# EAGLE board AK4493-Combi7 (EAGLE 9.6.2), part 1 of 2
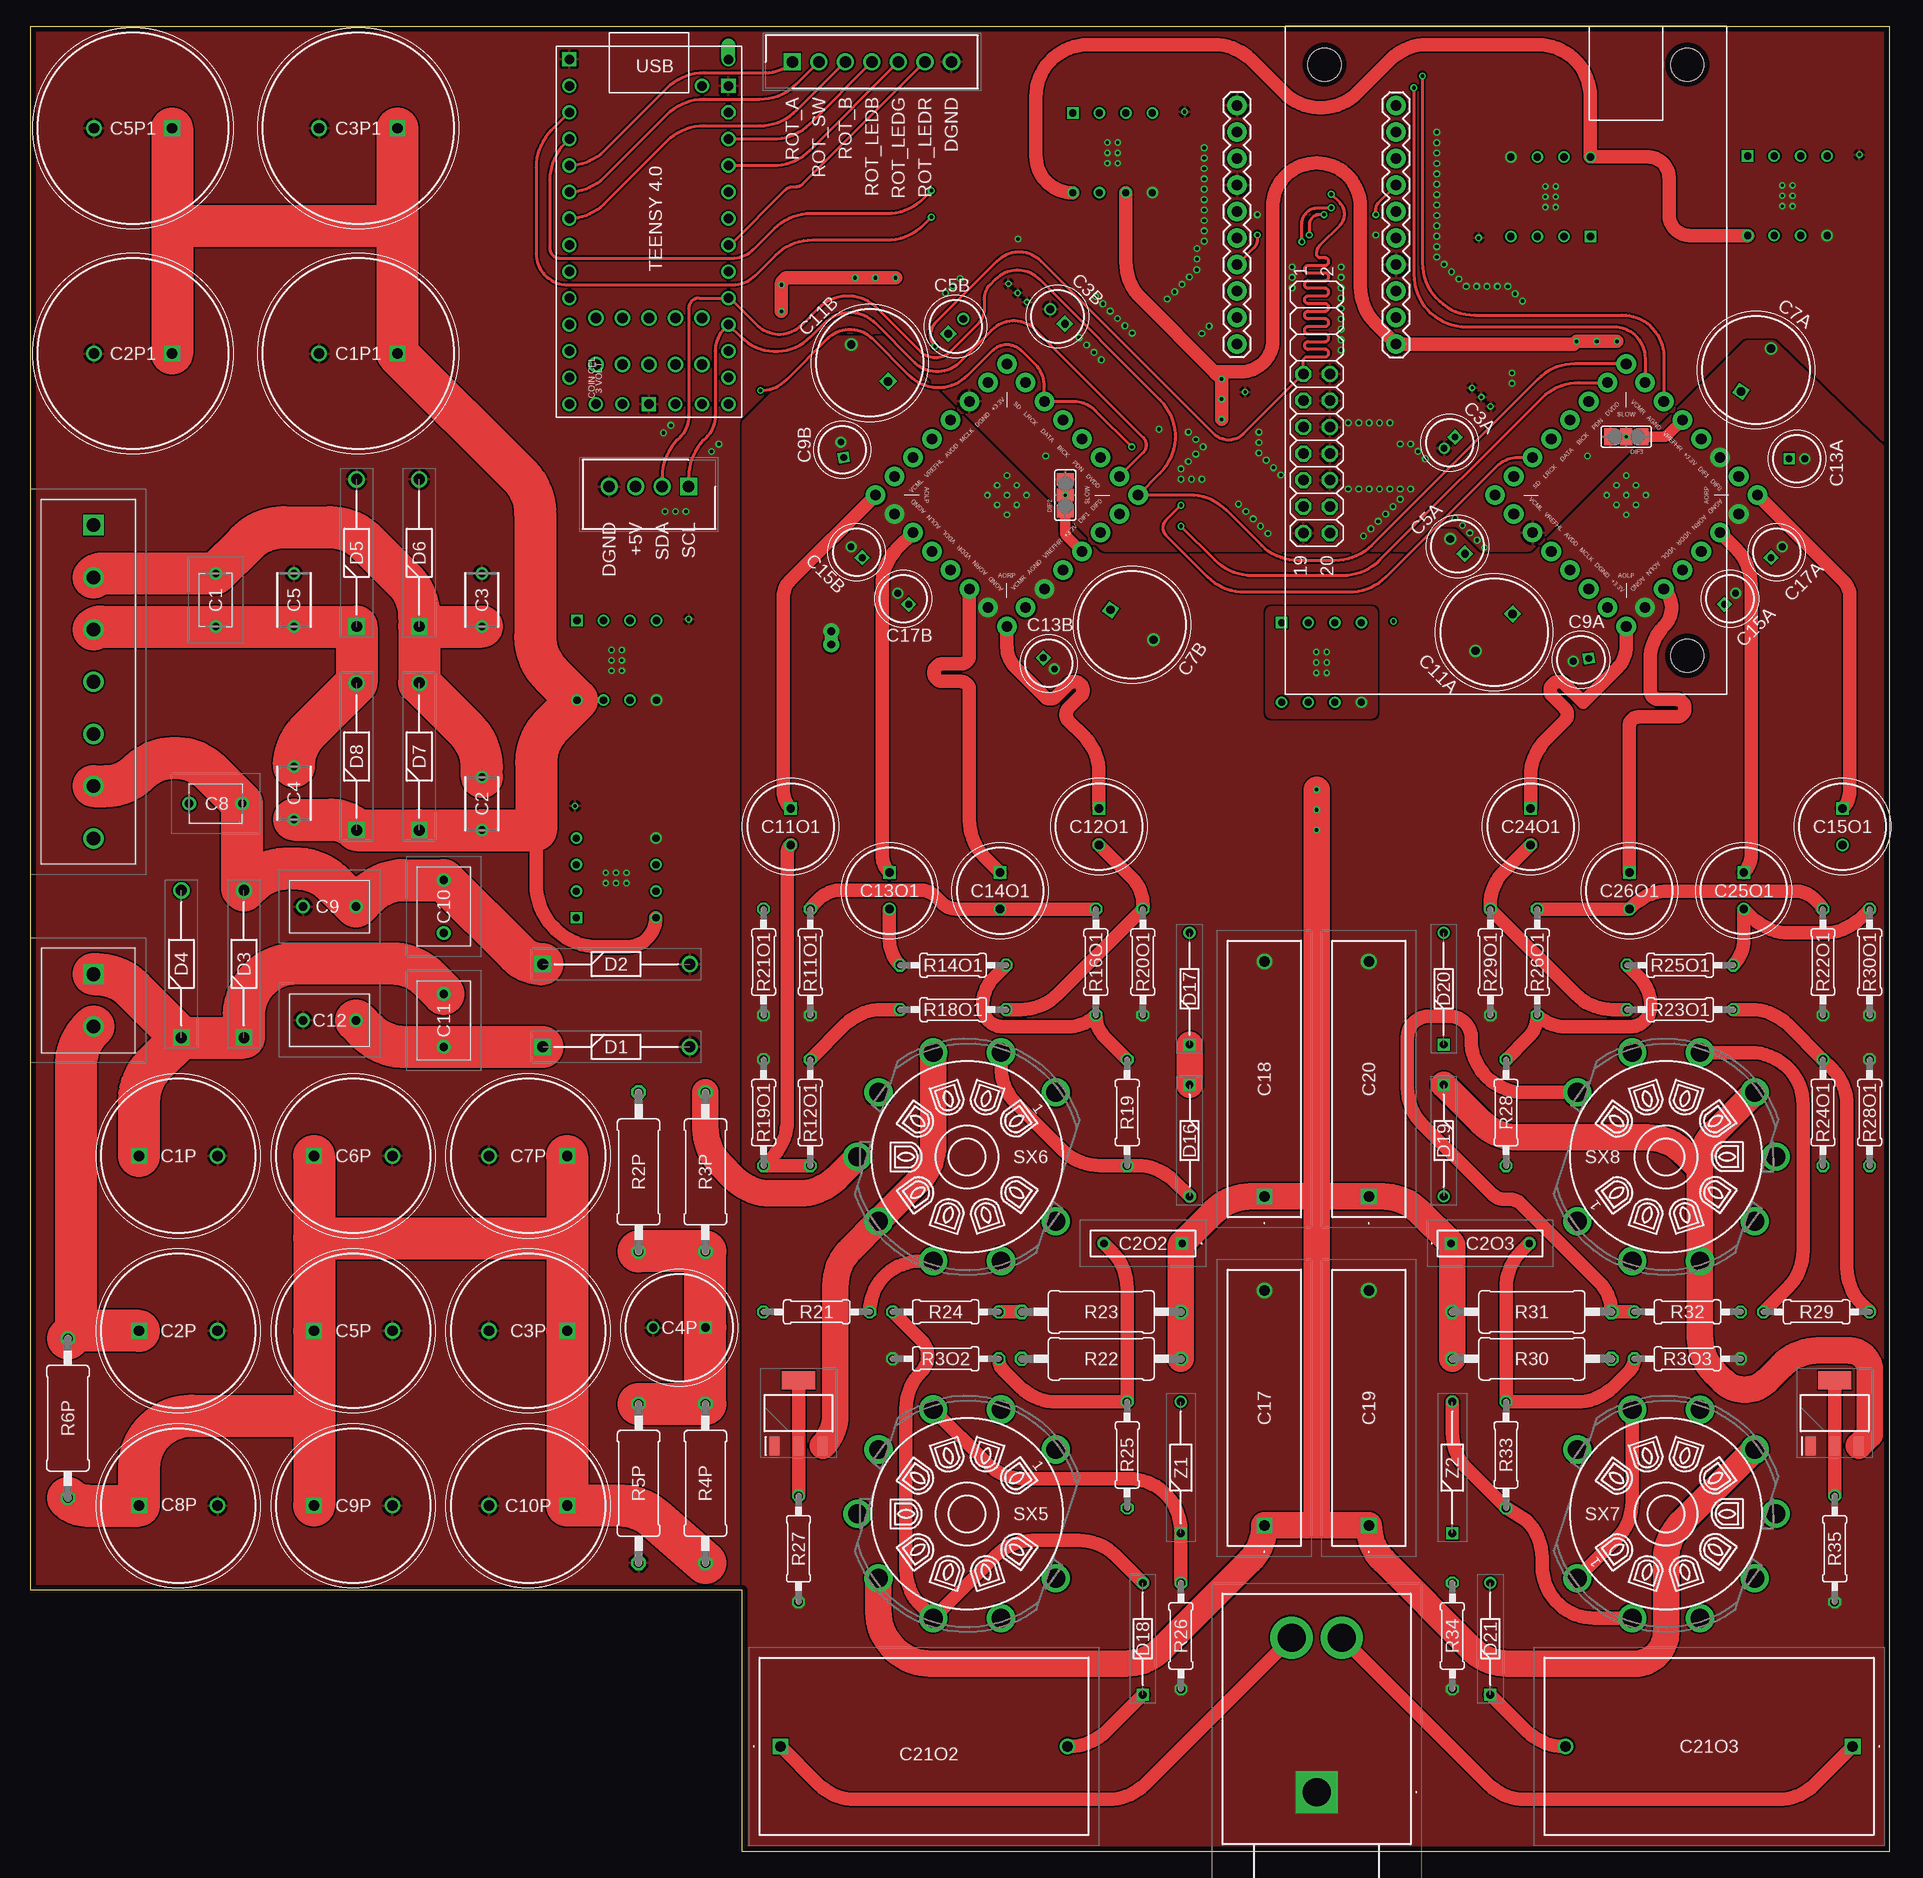
[diagram p5: board, top side]
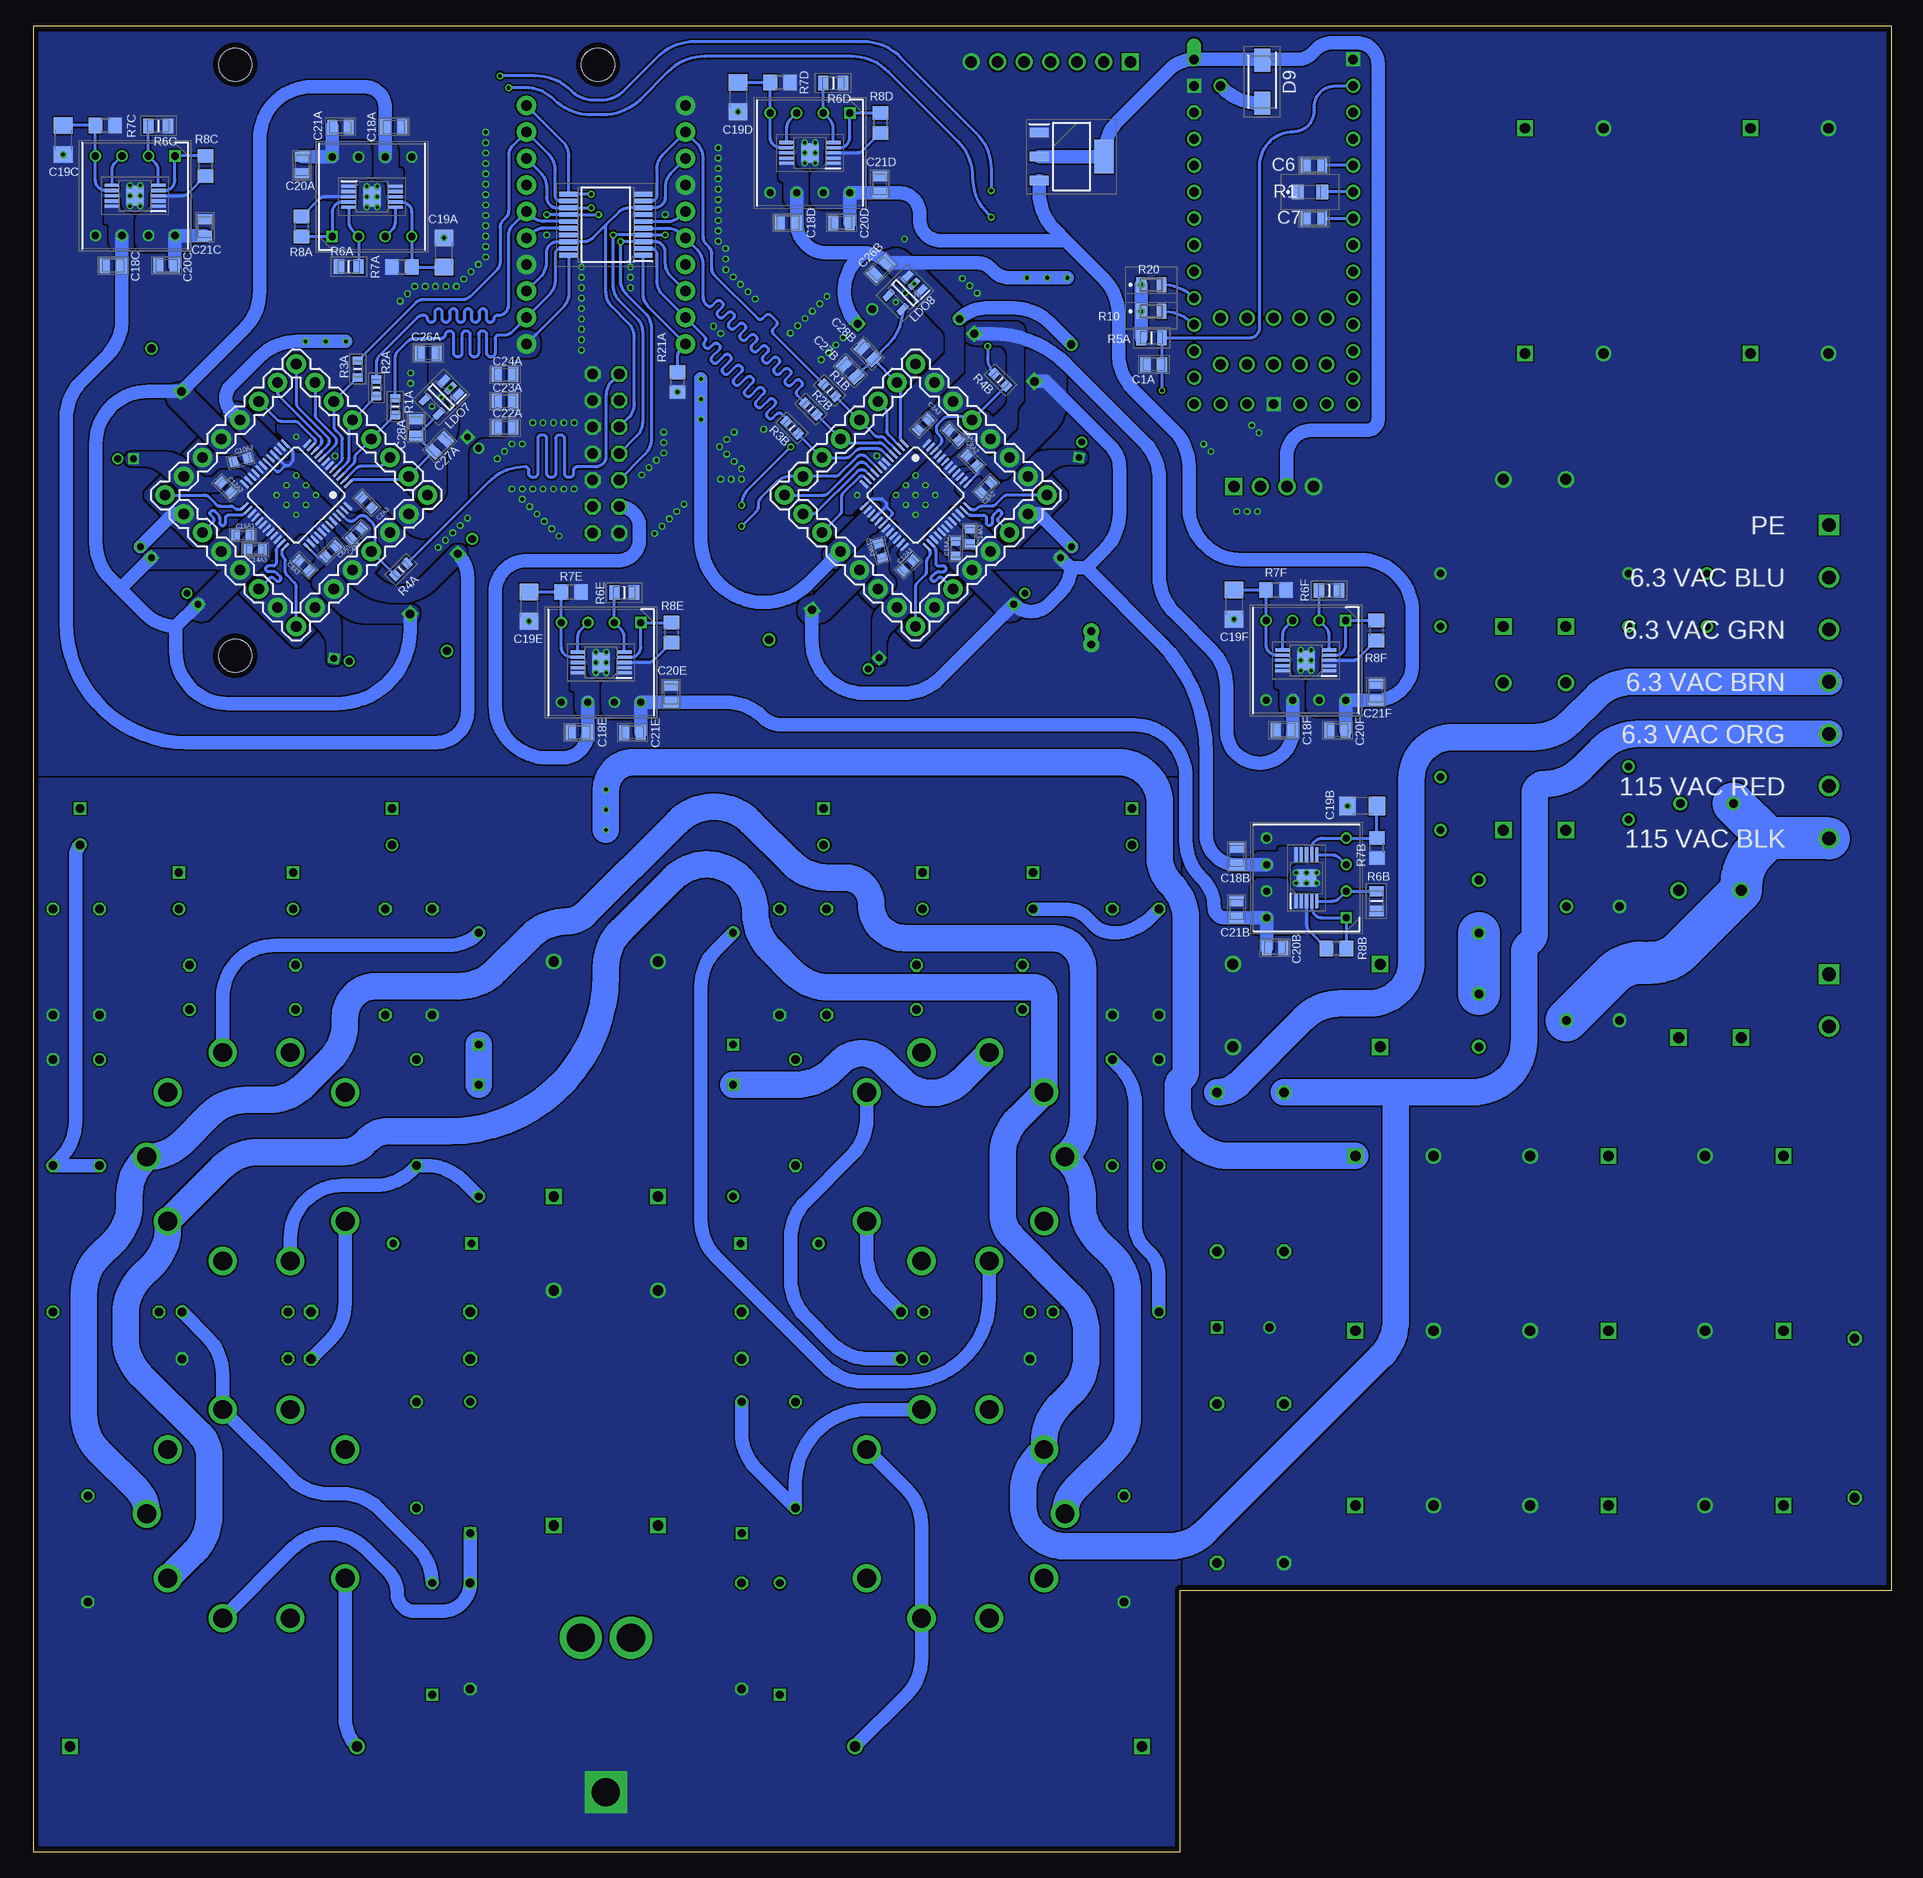
[diagram p6: board, bottom side, seen from below]

Size 178 x 174.85 mm. Coordinates in mm from the lower left corner, seen from the top.
Outline: 0,174.85 178,174.85 178,0 68.15,0 68.15,25.05 0,25.05 0,174.85
Copper layers (1*16): Top 0.035mm / dielectric 1.6mm / Bottom 0.035mm
Design rules "Elecrow_2-layer_PCB_eagle_rule": minimum track width 6mil, minimum drill 12mil, track to track 6mil, track to pad 6mil, pad to pad 6mil, via to via 8mil, smd to smd 0mil, copper to edge 20mil, drill to drill 10mil, minimum pad ring 6mil, minimum via ring 6mil, stop-mask expansion 0mil, vias tented up to drill 100mil, thermal gap 10mil
Net classes: 3 Power: width 1.27 mm, drill 1.27 mm, clearance 0.254 mm

## Footprints (pad centres in the part's own frame; a part is rotated, then mirrored left to right if it is on the bottom)
I2SOVERUSBV3 = drill 1.016 octagon: H3.7 33.322,1.745; H3.8 33.322,4.285; H3.9 35.862,1.745; H3.10 35.862,4.285; H3.11 38.403,1.745; H3.12 38.403,4.285; H3.13 40.943,1.745; H3.14 40.943,4.285; H3.15 43.483,1.745; H3.16 43.483,4.285; H3.17 46.023,1.745; H3.18 46.023,4.285; H3.19 48.562,1.745; H3.20 48.562,4.285 | hole 3.175: 3.688,3.775; 3.688,38.525; 60.312,38.525
SR211C104KARTR1 = drill 0.71 pad 1.21: 1 -2.54,0; 2 2.54,0
CAPC2012X135N = smd 0.96 x 1.39: 1 -0.79,0; 2 0.79,0
CAPPRD750W80D1475H4700 = drill 1 pad 1.5 square: 1 0,0 | drill 1 pad 1.5: 2 7.5,0
CAPPRD750W80D1825H3750 = drill 1 pad 1.5 square: 1 0,0 | drill 1 pad 1.5: 2 7.5,0
C322C104K1R5TA = drill 0.71 pad 1.21: 1 -2.54,0; 2 2.54,0
CAPC1608X95N = smd 0.81 x 0.99: 1 -0.69,0; 2 0.69,0
MKS4B031002A00JC00 = drill 0.7 pad 1.2 square: 1 0,0 | drill 0.7 pad 1.2: 2 7.5,0
CAPPRD150W45D450H600 = drill 0.65 pad 1.05 square: 1 0,0 | drill 0.65 pad 1.05: 2 1.5,0
CAPPRD200W55D500H800 = drill 0.75 pad 1.15 square: 1 0,0 | drill 0.75 pad 1.15: 2 2,0
CAPPRD500W60D1025H1750 = drill 0.8 pad 1.2 square: 1 0,0 | drill 0.8 pad 1.2: 2 5,0
CAPPRD500W60D1025H2150 = drill 0.8 pad 1.2 square: 1 0,0 | drill 0.8 pad 1.2: 2 5,0
C322C101JCG5TA7301 = drill 0.81 pad 1.316: 1 -2.54,0; 2 2.54,0
C330C104KDR5TA = drill 0.81 pad 1.316: 1 -2.54,0; 2 2.54,0
CAPPRD350W60D825H1300 = drill 0.8 pad 1.2 square: 1 0,0 | drill 0.8 pad 1.2: 2 3.5,0
MKP4G034705D00KSSD = drill 1 pad 1.5 square: 1 0,0 | drill 1 pad 1.5: 2 22.5,0
CAPC2013X140N = smd 0.96 x 1.44: 1 -0.82,0; 2 0.82,0
C1206 = smd 1.6 x 1.8: 1 -1.4,0; 2 1.4,0 | drill 0.35: 3 1.4,0
DCP4G053006ID2KSSD = drill 1 pad 1.5 square: 1 0,0 | drill 1 pad 1.5: 2 27.5,0
DIOAD1405W86L465D235 = drill 1.05 pad 1.575 square: 1 0,0 | drill 1.05 pad 1.575: 2 14.1,0
DIOM5027X244N = smd 2.2 x 1.55: 1 -2.05,0; 2 2.05,0
DIOAD1068W53L380D172 = drill 0.75 pad 1.15 square: 1 0,0 | drill 0.75 pad 1.15: 2 10.7,0
SJ_2 = smd 1.168 x 1.6: 1 -1.524,0; 2 0,0; 3 1.524,0
SOP50P490X110-11N = smd 1.425 x 0.3: 1 -2.212,1; 2 -2.212,0.5; 3 -2.212,0; 4 -2.212,-0.5; 5 -2.212,-1; 6 2.212,-1; 7 2.212,-0.5; 8 2.212,0; 9 2.212,0.5; 10 2.212,1 | smd 1.68 x 1.88: 11 0,0 | drill 0.305 pad 0.61: P$1 -0.498,0; P$2 0.498,0; P$3 -0.498,0.995; P$4 0.498,0.995; P$5 -0.498,-0.995; P$6 0.498,-0.995
LQFP48_ = smd 0.25 x 1: 1 -2.75,-4.25; 2 -2.25,-4.25; 3 -1.75,-4.25; 4 -1.25,-4.25; 5 -0.75,-4.25; 6 -0.25,-4.25; 7 0.25,-4.25; 8 0.75,-4.25; 9 1.25,-4.25; 10 1.75,-4.25; 11 2.25,-4.25; 12 2.75,-4.25; 25 2.75,4.25; 26 2.25,4.25; 27 1.75,4.25; 28 1.25,4.25; 29 0.75,4.25; 30 0.25,4.25; 31 -0.25,4.25; 32 -0.75,4.25; 33 -1.25,4.25; 34 -1.75,4.25; 35 -2.25,4.25; 36 -2.75,4.25 | smd 1 x 0.25: 13 4.25,-2.75; 14 4.25,-2.25; 15 4.25,-1.75; 16 4.25,-1.25; 17 4.25,-0.75; 18 4.25,-0.25; 19 4.25,0.25; 20 4.25,0.75; 21 4.25,1.25; 22 4.25,1.75; 23 4.25,2.25; 24 4.25,2.75; 37 -4.25,2.75; 38 -4.25,2.25; 39 -4.25,1.75; 40 -4.25,1.25; 41 -4.25,0.75; 42 -4.25,0.25; 43 -4.25,-0.25; 44 -4.25,-0.75; 45 -4.25,-1.25; 46 -4.25,-1.75; 47 -4.25,-2.25; 48 -4.25,-2.75 | drill 0.305 pad 0.61: P$1 0,0; P$2 -1.327,0; P$4 1.327,0; P$6 0,1.327; P$8 0,-1.327; P$10 -1.327,-1.327; P$17 1.327,-1.327; P$18 1.327,1.327; P$25 -1.327,1.327
SOP65P780X200-20N = smd 1.8 x 0.45: 1 -3.55,2.925; 2 -3.55,2.275; 3 -3.55,1.625; 4 -3.55,0.975; 5 -3.55,0.325; 6 -3.55,-0.325; 7 -3.55,-0.975; 8 -3.55,-1.625; 9 -3.55,-2.275; 10 -3.55,-2.925; 11 3.55,-2.925; 12 3.55,-2.275; 13 3.55,-1.625; 14 3.55,-0.975; 15 3.55,-0.325; 16 3.55,0.325; 17 3.55,0.975; 18 3.55,1.625; 19 3.55,2.275; 20 3.55,2.925
1935213 = drill 1.3 pad 1.95 square: 1 0,0 | drill 1.3 pad 1.95: 2 5,0; 3 10,0; 4 15,0; 5 20,0; 6 25,0; 7 30,0
1X07 = drill 1.016 pad 1.88: 1 0,0; 2 2.54,0; 3 5.08,0; 4 7.62,0; 5 10.16,0; 6 12.7,0; 7 15.24,0
SHDR7W64P0X254_1X7_2033X508X11 = drill 1.1 pad 1.65 square: 1 0,0 | drill 1.1 pad 1.65: 2 2.54,0; 3 5.08,0; 4 7.62,0; 5 10.16,0; 6 12.7,0; 7 15.24,0
SHDR4W64P0X254_1X4_1271X660X11 = drill 1.1 pad 1.65 square: 1 0,0 | drill 1.1 pad 1.65: 2 2.54,0; 3 5.08,0; 4 7.62,0
DIPS762W51P254L1016H390Q8N = drill 0.7 pad 1.1 square: 1 0,0 | drill 0.7 pad 1.1: 2 0,-2.54; 3 0,-5.08; 4 0,-7.62; 5 7.62,-7.62; 6 7.62,-5.08; 7 7.62,-2.54; 8 7.62,0
1X10 = drill 1.016 pad 1.88: 1 0,0; 2 2.54,0; 3 5.08,0; 4 7.62,0; 5 10.16,0; 6 12.7,0; 7 15.24,0; 8 17.78,0; 9 20.32,0; 10 22.86,0
SJ63033A = drill 2.69 pad 4.035 square: 1 0,0 | drill 2.69 pad 4.035: 2 14.8,-2.4; 3 14.8,2.4
1935161 = drill 1.3 pad 1.95 square: 1 0,0 | drill 1.3 pad 1.95: 2 5,0
SOT95P280X145-5N = smd 1.2 x 0.6: 1 -1.25,0.95; 2 -1.25,0; 3 -1.25,-0.95; 4 1.25,-0.95; 5 1.25,0.95 | drill 0.305 pad 0.61: 6 -1.25,0; 7 0,0; 8 1.25,0
ERJP06D1000V = smd 1.15 x 1.4: 1 -1.175,0; 2 1.175,0
RESC1608X55N = smd 0.8 x 0.95: 1 -0.8,0; 2 0.8,0
0411/15 = drill 0.914 octagon: 1 -7.62,0; 2 7.62,0
0207/10 = drill 0.813 octagon: 1 -5.08,0; 2 5.08,0
RESC2012X50N = smd 0.95 x 1.45: 1 -1,0; 2 1,0
RESC2012X60N = smd 1 x 1.4: 1 -0.95,0; 2 0.95,0
R0805 = smd 1.3 x 1.5: 1 -0.95,0; 2 0.95,0
RCS0805_E3 = smd 0.95 x 1.45: 1 -0.975,0; 2 0.975,0
R0805-POL = smd 1.3 x 1.5: 1 -0.95,0; 2 0.95,0 | drill 0.305 pad 0.61: 3 0.95,0
SHORT_ALL-50 = drill 0.737 pad 1.524: 1 -0.635,0; 2 0.635,0
VT9-PT = drill 1.8 pad 2.4: 1 6.172,8.495; 2 0,10.5; 3 -6.172,8.495; 4 -9.986,3.245; 5 -9.986,-3.245; 6 -6.172,-8.495; 7 0,-10.5; 8 6.172,-8.495; 9 9.986,-3.244
SOT230P700X180-4N@1 = smd 1.85 x 0.9: 1 -3.1,2.3; 2 -3.1,0; 3 -3.1,-2.3 | smd 1.85 x 3.2: 4 3.1,0
SOT230P700X180-4N = smd 1.75 x 0.95: 1 -3.15,2.3; 2 -3.15,0; 3 -3.15,-2.3 | smd 1.75 x 3.2: 4 3.15,0
TEENSY40 = drill 0.9: 0-RX1 -13.97,-7.62; 1-TX1 -11.43,-7.62; 2-OUT2 -8.89,-7.62; 3-LRCLK2 -6.35,-7.62; 3V3-2 16.51,-2.54; 4-BCLK2 -3.81,-7.62; 5-IN2 -1.27,-7.62; 6-OUT1D 1.27,-7.62; 7-RX2/OUT1A 3.81,-7.62; 8-TX2/IN1 6.35,-7.62; 9-OUT1C 8.89,-7.62; 10-CS/MQSR 11.43,-7.62; 11-MOSI/CTX1 13.97,-7.62; 12-MIO/MQSL 16.51,-7.62; 13-SCK/CRX1/LED 16.51,7.62; 14-A0/TX3/S-PFI_OUT 13.97,7.62; 15-A1/RX3/S-PDIF_IN 11.43,7.62; 16-A2/RX4/SCL1 8.89,7.62; 17-A3/TX4/SDA1 6.35,7.62; 18-A4/SDA0 3.81,7.62; 19-A5/SCL0 1.27,7.62; 20-A6/TX5/LRCLK1 -1.27,7.62; 21-A7/RX5/BCLK1 -3.81,7.62; 22-A8/CTX1 -6.35,7.62; 23-A9/CRX1/CCLK1 -8.89,7.62; ON/OFF 16.51,5.08; PROGRAM 16.51,2.54; VBAT 16.51,-5.08; VUSB -13.97,5.08 | drill 0.9 octagon: 3V3-1 -11.43,7.62 | drill 1: 24-A10/TX6/SCL2 12.7,5.08; 25-A11/SDA2 8.255,5.08; 26-A12/MOSI1 12.7,2.54; 27-A13/SCK1 8.255,2.54; 28-RX7 12.7,0; 29-TX7 8.255,0; 30-CRX3 12.7,-2.54; 31-CTX3 8.255,-2.54; 32-OUTB1 12.7,-5.08; 33-MCLK2 8.255,-5.08 | drill 0.9 square: GND1 -16.51,-7.62; GND2 16.51,0; GND3 -13.97,7.62 | drill 0.9 offset: VIN -16.51,7.62
DIOAD1256W56L444D203 = drill 0.75 pad 1.15 square: 1 0,0 | drill 0.75 pad 1.15: 2 12.6,0

## Placement (x,y rotation side)
BD1  I2SOVERUSBV3  [I2SOVERUSBV3]  120.14,174.85 270 top
C1  SR215C103KARTR1  [SR211C104KARTR1]  17.7,119.88 90 top
C1A  0.1uF, X7R  [CAPC2012X135N]  70.68,142.45 180 bottom
C1P  68u  [CAPPRD750W80D1475H4700]  10.38,66.64 0 top
C1P1  68u  [CAPPRD750W80D1825H3750]  35.11,143.49 180 top
C2  C322C104M5U5TA  [C322C104K1R5TA]  43.2,100.38 90 top
C2A2  0.1u, Ceramic Capacitor X7R  [CAPC1608X95N]  92.76,136.67 45 bottom
C2A3  0.1u, Ceramic Capacitor X7R  [CAPC1608X95N]  146.07,129.2 315 bottom
C2O2  0.1uF, 35V  [MKS4B031002A00JC00]  110.28,58.25 180 top
C2O3  0.1uF, 35V  [MKS4B031002A00JC00]  136.03,58.25 0 top
C2P  68u  [CAPPRD750W80D1475H4700]  10.38,49.89 0 top
C2P1  68u  [CAPPRD750W80D1825H3750]  13.54,143.49 180 top
C3  C322C104M5U5TA  [C322C104K1R5TA]  43.2,119.88 90 top
C3A  80-A758BG106M1EAAE70  [CAPPRD150W45D450H600]  136.42,135.49 225 top
C3B  80-A758BG106M1EAAE70  [CAPPRD200W55D500H800]  99.05,146.33 135 top
C3P  68u  [CAPPRD750W80D1475H4700]  51.38,49.89 180 top
C3P1  68u  [CAPPRD750W80D1825H3750]  35.11,165.07 180 top
C4  C322C104M5U5TA  [C322C104K1R5TA]  25.2,101.38 90 top
C4A2  0.1u, Ceramic Capacitor X7R  [CAPC1608X95N]  89.83,135.68 135 bottom
C4A3  0.1u, Ceramic Capacitor X7R  [CAPC1608X95N]  147.06,126.27 45 bottom
C4P  UCY2E220MPD1TD  [CAPPRD500W60D1025H1750]  64.61,50.19 180 top
C5  C322C104M5U5TA  [C322C104K1R5TA]  25.2,119.88 90 top
C5A  80-A758BG106M1EAAE70  [CAPPRD200W55D500H800]  137.36,124.32 135 top
C5B  80-A758BG106M1EAAE70  [CAPPRD200W55D500H800]  87.88,145.38 45 top
C5P  68u  [CAPPRD750W80D1475H4700]  27.13,49.89 0 top
C5P1  68u  [CAPPRD750W80D1825H3750]  13.54,165.07 180 top
C6  0.1 uF  [CAPC2012X135N]  55.34,161.5 180 bottom
C6A2  0.1u, Ceramic Capacitor X7R  [CAPC1608X95N]  88.09,133.24 315 bottom
C6A3  0.1u, Ceramic Capacitor X7R  [CAPC1608X95N]  149.51,124.53 225 bottom
C6P  68u  [CAPPRD750W80D1475H4700]  27.13,66.64 0 top
C7  0.1 uF  [CAPC2012X135N]  55.34,156.42 0 bottom
C7A  APSG160ELL222MJ20S  [CAPPRD500W60D1025H2150]  163.8,139.87 55 top
C7B  APSG160ELL222MJ20S  [CAPPRD500W60D1025H2150]  103.43,118.94 325 top
C7P  68u  [CAPPRD750W80D1475H4700]  51.38,66.64 180 top
C8  C322C103KDR5TA  [C322C101JCG5TA7301]  17.7,100.38 0 top
C8A2  0.1u, Ceramic Capacitor X7R  [CAPC1608X95N]  86.75,130.66 45 bottom
C8A3  0.1u, Ceramic Capacitor X7R  [CAPC1608X95N]  152.09,123.19 315 bottom
C8P  68u  [CAPPRD750W80D1475H4700]  10.38,33.14 0 top
C9  C330C104KDR5TA  [C330C104KDR5TA]  28.61,90.52 180 top
C9A  647-RNU1A100MDSASQ  [CAPPRD150W45D450H600]  149.21,114.29 190 top
C9B  647-RNU1A100MDSASQ  [CAPPRD150W45D450H600]  77.85,133.53 100 top
C9P  68u  [CAPPRD750W80D1475H4700]  27.13,33.14 0 top
C10  C330C104KDR5TA  [C330C104KDR5TA]  39.55,90.52 90 top
C10A2  0.1u, Ceramic Capacitor X7R  [CAPC1608X95N]  96.87,124.61 285 bottom
C10A3  0.1u, Ceramic Capacitor X7R  [CAPC1608X95N]  158.14,133.31 195 bottom
C10P  68u  [CAPPRD750W80D1475H4700]  51.38,33.14 180 top
C11  C330C104KDR5TA  [C330C104KDR5TA]  39.55,79.62 270 top
C11A  APSG160ELL222MJ20S  [CAPPRD500W60D1025H2150]  141.92,118.55 225 top
C11B  2200uF, 10V  [CAPPRD500W60D1025H2150]  82.11,140.83 135 top
C11O1  100uF  [CAPPRD350W60D825H1300]  72.78,99.93 270 top
C12  C330C104KDR5TA  [C330C104KDR5TA]  28.61,79.62 180 top
C12A2  0.1u, Ceramic Capacitor X7R  [CAPC1608X95N]  94.21,123.2 45 bottom
C12A3  0.1u, Ceramic Capacitor X7R  [CAPC1608X95N]  159.55,130.65 315 bottom
C12O1  100uF  [CAPPRD350W60D825H1300]  102.3,99.93 270 top
C13A  647-RNU1A100MDSASQ  [CAPPRD150W45D450H600]  168.41,133.42 0 top
C13B  647-RNU1A100MDSASQ  [CAPPRD150W45D450H600]  96.98,114.34 315 top
C13O1  100uF  [CAPPRD350W60D825H1300]  82.24,93.78 270 top
C14A2  0.1u, Ceramic Capacitor X7R  [CAPC1608X95N]  88.27,126.01 270 bottom
C14A3  0.1u, Ceramic Capacitor X7R  [CAPC1608X95N]  156.74,124.71 180 bottom
C14O1  100uF  [CAPPRD350W60D825H1300]  92.84,93.78 270 top
C15A  647-RNU1A100MDSASQ  [CAPPRD150W45D450H600]  162.22,119.47 45 top
C15B  647-RNU1A100MDSASQ  [CAPPRD150W45D450H600]  79.62,123.93 135 top
C15O1  100uF  [CAPPRD350W60D825H1300]  173.53,99.93 270 top
C16A2  0.1u, Ceramic Capacitor X7R  [CAPC1608X95N]  89.65,124.8 90 bottom
C16A3  0.1u, Ceramic Capacitor X7R  [CAPC1608X95N]  157.94,126.09 0 bottom
C17  MKP4G034705D00KSSD  [MKP4G034705D00KSSD]  118.15,31.25 90 top
C17A  647-RNU1A100MDSASQ  [CAPPRD150W45D450H600]  166.68,123.93 45 top
C17B  647-RNU1A100MDSASQ  [CAPPRD150W45D450H600]  84.08,119.47 135 top
C18  MKP4G034705D00KSSD  [MKP4G034705D00KSSD]  118.15,62.75 90 top
C18A  4.7u  [CAPC2013X140N]  143.47,165.2 0 bottom
C18B  4.7u  [CAPC2013X140N]  62.75,95.35 90 bottom
C18C  4.7u  [CAPC2013X140N]  170.34,151.91 180 bottom
C18D  4.7u  [CAPC2013X140N]  105.7,156.02 180 bottom
C18E  4.7u  [CAPC2013X140N]  125.71,107.21 180 bottom
C18F  4.7u  [CAPC2013X140N]  58.2,107.41 180 bottom
C19  MKP4G034705D00KSSD  [MKP4G034705D00KSSD]  128.15,31.25 90 top
C19A  22u  [C1206]  138.67,153.17 90 bottom
C19B  22u  [C1206]  50.71,100.15 180 bottom
C19C  22u  [C1206]  175.14,163.94 270 bottom
C19D  22u  [C1206]  110.5,168.05 270 bottom
C19E  22u  [C1206]  130.52,119.24 270 bottom
C19F  22u  [C1206]  63,119.44 270 bottom
C20  MKP4G034705D00KSSD  [MKP4G034705D00KSSD]  128.15,62.75 90 top
C20A  10u  [CAPC2012X135N]  152.26,161.53 270 bottom
C20B  10u  [CAPC2012X135N]  59.07,86.57 0 bottom
C20C  10u  [CAPC2012X135N]  165.23,151.91 180 bottom
C20D  10u  [CAPC2012X135N]  100.59,156.02 180 bottom
C20E  10u  [CAPC2012X135N]  116.93,110.88 90 bottom
C20F  10u  [CAPC2012X135N]  53.09,107.41 180 bottom
C21A  0.1u  [CAPC2012X135N]  148.58,165.2 0 bottom
C21B  0.1u  [CAPC2012X135N]  62.75,90.24 90 bottom
C21C  0.1u  [CAPC2012X135N]  161.56,155.58 90 bottom
C21D  0.1u  [CAPC2012X135N]  96.92,159.69 90 bottom
C21E  0.1u  [CAPC2012X135N]  120.6,107.21 180 bottom
C21F  0.1u  [CAPC2012X135N]  49.41,111.08 90 bottom
C21O2  30uF/400V  [DCP4G053006ID2KSSD]  71.8,10.08 0 top
C21O3  30uF/400V  [DCP4G053006ID2KSSD]  174.5,10.08 180 top
C22A  0.1u, Ceramic Capacitor X7R  [CAPC2012X135N]  132.8,136.39 0 bottom
C23A  0.1u, Ceramic Capacitor X7R  [CAPC2012X135N]  132.8,138.93 0 bottom
C24A  0.1u, Ceramic Capacitor X7R  [CAPC2012X135N]  132.8,141.47 0 bottom
C24O1  100uF  [CAPPRD350W60D825H1300]  143.65,99.93 270 top
C25O1  100uF  [CAPPRD350W60D825H1300]  164.07,93.78 270 top
C26A  4.7u, Ceramic Capacitor X7R  [CAPC2013X140N]  140.17,143.53 180 bottom
C26B  4.7u, Ceramic Capacitor X7R  [CAPC2013X140N]  96.83,151.61 225 bottom
C26O1  100uF  [CAPPRD350W60D825H1300]  153.11,93.78 270 top
C27A  4.7u, Ceramic Capacitor X7R  [CAPC2013X140N]  139.08,134.69 45 bottom
C27B  4.7u, Ceramic Capacitor X7R  [CAPC2013X140N]  99.76,141.87 135 bottom
C28A  0.1u, Ceramic Capacitor X7R  [CAPC2012X135N]  141.35,136.43 90 bottom
C28B  0.1u, Ceramic Capacitor X7R  [CAPC2012X135N]  98.08,143.51 135 bottom
D1  1N4007FFG  [DIOAD1405W86L465D235]  49.01,77.08 0 top
D2  1N4007FFG  [DIOAD1405W86L465D235]  49.01,85 0 top
D3  1N4007FFG  [DIOAD1405W86L465D235]  20.41,77.97 90 top
D4  1N4007FFG  [DIOAD1405W86L465D235]  14.41,77.97 90 top
D5  1N4007FFG  [DIOAD1405W86L465D235]  31.2,117.34 90 top
D6  1N4007FFG  [DIOAD1405W86L465D235]  37.2,117.34 90 top
D7  1N4007FFG  [DIOAD1405W86L465D235]  37.2,97.84 90 top
D8  1N4007FFG  [DIOAD1405W86L465D235]  31.2,97.84 90 top
D9  SS14_R2_00001  [DIOM5027X244N]  60.3,169.51 270 bottom
D16  1N4148-T50R  [DIOAD1068W53L380D172]  110.98,73.45 270 top
D17  1N4148-T50R  [DIOAD1068W53L380D172]  110.98,77.3 90 top
D18  1N4148-T50R  [DIOAD1068W53L380D172]  106.51,15.04 90 top
D19  1N4148-T50R  [DIOAD1068W53L380D172]  135.33,73.45 270 top
D20  1N4148-T50R  [DIOAD1068W53L380D172]  135.33,77.3 90 top
D21  1N4148-T50R  [DIOAD1068W53L380D172]  139.8,15.04 90 top
DIF2  [SJ_2]  99.08,129.93 270 top
DIF3  [SJ_2]  152.81,135.52 0 top
IC1  LT3042  [SOP50P490X110-11N]  145.56,158.51 0 bottom
IC3  AK4493  [LQFP48_]  93.49,129.93 225 bottom
IC4  LT3042  [SOP50P490X110-11N]  168.25,158.6 180 bottom
IC4A  SN74ABT273DBR  [SOP65P780X200-20N]  123.15,155.82 180 bottom
IC5  LT3042  [SOP50P490X110-11N]  56.05,93.26 90 bottom
IC6  LT3042  [SOP50P490X110-11N]  103.61,162.71 180 bottom
IC7  LT3042  [SOP50P490X110-11N]  56.11,114.1 180 bottom
IC8  LT3042  [SOP50P490X110-11N]  123.62,113.9 180 bottom
IC9  AK4493  [LQFP48_]  152.81,129.93 135 bottom
IN  1935213  [1935213]  6,127.05 270 top
J1  [1X07]  93.49,117.36 135 bottom
J2  [1X07]  80.92,129.93 225 bottom
J3  [1X07]  93.49,142.5 315 bottom
J4  [1X07]  106.06,129.93 45 bottom
J5  70543-0041  [SHDR7W64P0X254_1X7_2033X508X11]  72.93,171.43 0 top
J6  70543-0038  [SHDR4W64P0X254_1X4_1271X660X11]  63.01,130.75 180 top
J9  [1X07]  165.39,129.93 45 bottom
J10  [1X07]  152.81,117.36 135 bottom
J11  [1X07]  140.24,129.93 225 bottom
J12  [1X07]  152.81,142.5 315 bottom
J15  XR2A-0811-N  [DIPS762W51P254L1016H390Q8N]  149.37,154.7 90 bottom
J16  XR2A-0811-N  [DIPS762W51P254L1016H390Q8N]  164.44,162.41 270 bottom
J17  XR2A-0811-N  [DIPS762W51P254L1016H390Q8N]  52.24,89.45 180 bottom
J18  XR2A-0811-N  [DIPS762W51P254L1016H390Q8N]  99.8,166.52 270 bottom
J19  XR2A-0811-N  [DIPS762W51P254L1016H390Q8N]  52.3,117.91 270 bottom
J20  XR2A-0811-N  [DIPS762W51P254L1016H390Q8N]  119.81,117.71 270 bottom
J21  [1X10]  115.53,167.25 270 top
J22  [1X10]  130.77,144.39 90 top
J26  SJ-63033A  [SJ63033A]  123.15,5.7 90 top
J27  1935161  [1935161]  6,84.04 270 top
LDO7  LP5907-1.8V  [SOT95P280X145-5N]  138.93,139.31 225 bottom
LDO8  LP5907-1.8V  [SOT95P280X145-5N]  94.52,149.3 225 bottom
R1  5k  [ERJP06D1000V]  55.73,158.96 0 bottom
R1A  RT0603DRE075R1L  [RESC1608X55N]  143.34,138.41 270 bottom
R1B  RT0603DRE075R1L  [RESC1608X55N]  101.74,139.97 315 bottom
R2A  RT0603DRE075R1L  [RESC1608X55N]  145.14,140.21 270 bottom
R2B  RT0603DRE075R1L  [RESC1608X55N]  103.53,138.18 315 bottom
R2P  220  [0411/15]  58.21,65.1 90 top
R3A  RT0603DRE075R1L  [RESC1608X55N]  146.93,142 270 bottom
R3B  RT0603DRE075R1L  [RESC1608X55N]  105.33,136.38 315 bottom
R3O2  1M*  [0207/10]  87.63,47.2 180 top
R3O3  1M*  [0207/10]  158.68,47.2 0 top
R3P  220  [0411/15]  64.61,65.1 270 top
R4A  RT0603DRE075R1L  [RESC1608X55N]  142.77,122.82 225 bottom
R4B  RT0603DRE075R1L  [RESC1608X55N]  85.38,140.97 315 bottom
R4P  300k  [0411/15]  64.61,35.27 270 top
R5A  10K, Resistor 1%  [RESC2012X50N]  70.89,144.99 180 bottom
R5P  100k  [0411/15]  58.21,35.27 90 top
R6A  1k  [RESC2012X60N]  147.78,151.82 180 bottom
R6B  1k  [RESC2012X60N]  49.36,91.04 270 bottom
R6C  1k  [RESC2012X60N]  166.03,165.29 0 bottom
R6D  1k  [RESC2012X60N]  101.39,169.4 0 bottom
R6E  1k  [RESC2012X60N]  121.4,120.59 0 bottom
R6F  1k  [RESC2012X60N]  53.89,120.79 0 bottom
R6P  330  [0411/15]  3.54,41.51 90 top
R7A  33k  [R0805]  142.7,151.77 180 bottom
R7B  33k  [R0805]  49.31,96.12 270 bottom
R7C  33k  [R0805]  171.11,165.34 0 bottom
R7D  33k  [R0805]  106.47,169.45 0 bottom
R7E  33k  [R0805]  126.48,120.64 0 bottom
R7F  33k  [R0805]  58.97,120.84 0 bottom
R8A  200k  [R0805]  152.31,155.65 270 bottom
R8B  200k  [R0805]  53.19,86.52 0 bottom
R8C  200k  [R0805]  161.51,161.46 90 bottom
R8D  200k  [R0805]  96.87,165.57 90 bottom
R8E  200k  [R0805]  116.88,116.76 90 bottom
R8F  200k  [R0805]  49.36,116.96 90 bottom
R10  2.2k, 1%  [RCS0805_E3]  70.92,147.53 0 bottom
R11O1  10k  [0207/10]  74.65,85.2 270 top
R12O1  182  [0207/10]  74.65,70.78 270 top
R14O1  182  [0207/10]  88.33,84.9 180 top
R16O1  182  [0207/10]  102.01,85.2 90 top
R18O1  182  [0207/10]  88.33,80.65 0 top
R19  1k  [0207/10]  105.01,70.78 90 top
R19O1  10k  [0207/10]  70.18,70.78 270 top
R20  2.2k, 1%  [RCS0805_E3]  70.92,150.07 0 bottom
R20O1  10k  [0207/10]  106.51,85.2 270 top
R21  1k  [0207/10]  75.26,51.7 180 top
R21A  Not Pop.  [R0805-POL]  116.31,140.75 270 bottom
R21O1  10k  [0207/10]  70.18,85.2 90 top
R22  9.1k  [0411/15]  102.53,47.2 0 top
R22O1  10k  [0207/10]  171.65,85.2 270 top
R23  9.1k  [0411/15]  102.53,51.7 0 top
R23O1  182  [0207/10]  157.97,80.65 180 top
R24  1k  [0207/10]  87.63,51.7 0 top
R24O1  182  [0207/10]  171.65,70.78 270 top
R25  1k  [0207/10]  105.01,38 90 top
R25O1  182  [0207/10]  157.97,84.9 0 top
R26  330  [0207/10]  110.15,20.66 90 top
R26O1  182  [0207/10]  144.29,85.2 90 top
R27  48.7  [0207/10]  73.53,29 90 top
R28  1k  [0207/10]  141.3,70.78 90 top
R28O1  10k  [0207/10]  176.12,70.78 270 top
R29  1k  [0207/10]  171.04,51.7 0 top
R29O1  10k  [0207/10]  139.8,85.2 270 top
R30  9.1k  [0411/15]  143.77,47.2 180 top
R30O1  10k  [0207/10]  176.12,85.2 90 top
R31  9.1k  [0411/15]  143.77,51.7 180 top
R32  1k  [0207/10]  158.68,51.7 180 top
R33  1k  [0207/10]  141.3,38 90 top
R34  330  [0207/10]  136.15,20.66 90 top
R35  48.7  [0207/10]  172.78,29 90 top
SH3  SHORTA5  [SHORT_ALL-50]  76.66,116.25 90 top
SX5  VT9-PT  [VT9-PT]  89.68,32.35 342 top
SX6  VT9-PT  [VT9-PT]  89.68,66.55 342 top
SX7  VT9-PT  [VT9-PT]  156.62,32.35 162 top
SX8  VT9-PT  [VT9-PT]  156.62,66.55 162 top
U1  AZ1117H-5.0TRE1  [SOT230P700X180-4N@1]  78.55,162.35 0 bottom
U4  LM317MQDCYR  [SOT230P700X180-4N]  73.53,42 90 top
U5  LM317MQDCYR  [SOT230P700X180-4N]  172.78,42 90 top
U$1  TEENSY40  [TEENSY40]  59.2,155.15 270 top
Z1  1N750  [DIOAD1256W56L444D203]  110.15,30.48 90 top
Z2  1N750  [DIOAD1256W56L444D203]  136.15,30.48 90 top

## Tracks (layer width: path | path; a pad name or v marks a point on that pad's centre or on a via)
6.3_VAC_BLU
  Top 4: C2.2 43.2,103.87 arc45 41.74,107.41 D7.2 D6.1 | D6.1 C3.1 | IN.2 arc-45 6.89,122.42 C1.2 20.67,125.39 arc-45 24.2,126.85 28.63,126.85 arc-45 32.16,125.39 35.74,121.82 arc-45 37.2,118.28 D6.1
6.3_VAC_GRN
  Top 4: C4.2 arc-45 26.63,107.37 D8.2 D5.1 C5.1 C1.1 6.7,117.34 arc45 IN.3
66.3VAC/1
  Bottom 2.54: IN.5 24.33,107.05 arc-45 27.86,105.59 29.74,103.72 arc45 33.27,102.25 arc-90 34.2,101.32 34.2,87.97 arc45 34.49,87.26 34.91,86.85 arc-45 35.2,86.14 35.2,77.72 arc90 40.2,72.72 47.6,72.72 | 47.6,72.72 R2P.2 | 47.6,72.72 47.5,72.62 47.5,50.92 arc45 48.96,47.39 65.64,30.72 arc45 69.17,29.25 79.2,29.25 arc90 83.2,33.25 83.2,34.44 arc45 81.74,37.97 SX5.4 81.19,39.2 arc45 79.72,42.73 78.62,43.84 arc-45 77.15,47.37 77.15,49.73 arc-45 78.62,53.26 84.27,58.92 arc45 85.15,61.04 85.15,66.68 arc45 83.69,70.22 SX6.4 81.19,81.77 arc-90 82.19,82.77 101.7,82.77 arc45 105.24,84.24 107.39,86.39 arc45 108.85,89.92 arc-135 116.76,93.2 121.69,88.26 arc-45 123.15,84.73 123.15,84 arc90 138.15,69 143.99,69 arc-45 145.97,68.18 146.33,67.82 arc45 148.31,67 156.43,67 arc-45 159.96,65.54 SX8.4 165.12,59.7 arc45 166.58,56.17 167.69,55.06 arc-45 169.15,51.53 169.15,49.17 arc-45 167.69,45.64 162.03,39.98 arc45 161.15,37.86 161.15,32.22 arc45 162.62,28.68 SX7.4
66.3VAC/2
  Top 2.54: R3P.1 64.61,69.31 arc45 66.07,65.78 67.34,64.52 arc45 70.87,63.05 73.61,63.05 arc45 77.15,64.52 SX6.5 | SX6.5
  Bottom 2.54: IN.4 24.83,112.05 arc-45 28.36,110.59 30.74,108.22 arc45 34.27,106.75 42,106.75 arc-90 46,102.75 46,85.25 arc90 50,81.25 52.81,81.25 arc-45 56.34,79.79 62.56,73.57 arc45 R3P.1 | SX5.5 arc45 78.19,34.74 74.62,38.31 arc-45 73.15,41.85 73.15,53.53 arc-45 74.62,57.06 76.03,58.48 arc45 77.5,62.01 77.5,62.8 arc-45 78.96,66.33 SX6.5 78.92,66.81 arc-45 77.45,70.35 77.45,84.5 arc-90 80.45,87.5 94.5,87.5 arc90 97.75,90.75 arc-90 100.3,93.3 101.88,93.3 arc45 105.42,94.76 109.27,98.61 arc-90 116.34,98.61 125.12,89.83 arc45 126.88,89.1 arc-45 130.42,87.64 133.69,84.36 arc45 137.22,82.9 145.15,82.9 arc-90 148.15,79.9 148.15,79.37 arc45 149.62,75.84 151.99,73.46 arc45 155.52,72 157.6,72 arc-45 161.14,70.54 163.71,67.96 arc45 SX8.5 167.34,66.33 arc-45 168.81,62.8 168.81,62.01 arc45 170.27,58.48 171.69,57.06 arc-45 173.15,53.53 173.15,41.85 arc-45 171.69,38.31 168.12,34.74 arc45 SX7.5
115_VAC_BLK
  Top 4: C12.1 32.22,78.55 arc45 35.76,77.08 C11.2 D1.1
  Bottom 4: IN.7 11.83,97.05 | 11.83,97.05 C8.1 | 11.83,97.05 12.95,95.94 arc-45 14.41,92.4 D4.2 20.16,86.32 arc45 22.99,85.15 23.96,85.15 arc-45 26.79,83.98 C12.1
115_VAC_RED
  Top 4: IN.6 7.23,102.05 arc45 10.25,103.3 arc-90 17.32,103.3 C8.2 20.25,92.24 D3.2 21.03,92.69 arc-45 24.57,94.15 25.45,94.15 arc-45 28.98,92.69 C9.1 32.22,91.6 arc-45 35.76,93.06 C10.2 46.61,86 arc45 D2.1
+3V3  (via drill 0.35)
  Top 1.016: 99.26,125.95 arc-45 99.08,126.39 DIF2.3 | 99.26,125.95 | 99.26,125.95 J1.5 | 156.79,135.7 arc-45 156.36,135.52 DIF3.3
  Top 1.06: J9.5 156.79,135.7
  Top 1.272: v82.82,150.75 v80.89,150.75 v78.95,150.75 72.57,150.75 arc90 R20.1 R10.1 | 113.35,141.75 106.34,148.76 arc-45 104.88,152.3 J18.6 | 113.35,141.75 115.95,141.75 arc90 118.95,144.75 118.95,157.55 arc-90 123.15,161.75 arc-90 127.35,157.55 127.35,149.88 arc45 128.82,146.35 J22.1 147.79,144.39 v148.05,144.65 v149.99,144.65 v151.92,144.65 | 113.35,141.75 v114.05,141.05 v114.05,139.12 v114.05,137.19
  Bottom 0.305: IC4A.20 126.7,149.29 arc45 127.29,147.88 J22.1
  Bottom 1.272: J18.6 C18D.1 arc-90 102.02,153.15 98.45,153.15 | v78.95,150.75 v80.89,150.75 v82.82,150.75 84.56,150.75 arc45 85.98,151.34 86.25,151.61 arc-45 87.66,152.19 C26B.1 96.34,152.28 arc-45 98.45,153.15 | v148.05,144.65 v149.99,144.65 v151.92,144.65 152.78,144.65 arc-45 156.32,143.19 159.05,140.45 arc-90 159.05,137.96 J9.5 | R20.1 R10.1 R5A.2 | 98.45,153.15 99.05,152.56 arc-90 C3B.1 | v114.05,141.05 v114.05,139.12 v114.05,137.19 114.05,125.65 arc-135 103.81,121.41 J1.5
  other vias: 71.89,147.53 71.89,150.07
  pour Bottom (no thermals): 93.8,148.78 92.46,147.44 90.56,149.35 94.26,153.05 arc-90 96.52,153.05 96.95,152.62 arc-90 96.95,152.16 94.92,150.13 arc-90 94.46,150.13 93.69,150.91 arc90 93.23,150.91 92.91,150.59 arc90 92.91,150.13 93.8,149.24 arc-90
  pour Bottom (no thermals): 90.79,149.58 89.21,147.96 arc44 88.93,147.27 88.93,141.78 90.62,143.47 90.62,145.14 arc-44 90.9,145.84 92.69,147.67
  pour Bottom (no thermals): 140.1,141.01 140.1,144 arc90 139.15,144.95 132.54,144.95 arc-45 131.84,145.25 131.72,145.36 arc45 131.02,145.65 130.51,145.65 arc90 129.51,144.65 129.51,144.13 arc90 130.51,143.13 131.83,143.13 arc-90 132.83,142.13 132.83,136.05 arc90 133.33,135.55 134.94,135.55 arc-45 135.65,135.26 136.13,134.77 arc-45 136.42,134.07 136.42,132.51 arc90 137.42,131.51 arc90 138.22,132.31 138.22,133.73 arc45 137.93,134.44 arc-45 137.06,136.55 137.06,138.22 arc-90 137.31,138.47 137.78,138.47 arc45 137.96,138.54 138.27,138.85 arc90 138.27,139.2 137.27,140.2 arc-90 137.27,140.55 137.69,140.98 arc-90 138.05,140.98 138.93,140.1 arc90 139.28,140.1 140.02,140.84 arc45
  pour Bottom (no thermals): 136.42,132.51 136.42,129.91 arc47 137.05,128.45 139.23,126.39 arc88 142.02,126.43 142.21,126.62 140.52,128.31 arc-90 139.66,128.31 138.52,129.45 arc-45 138.22,130.16 138.22,132.51
  pour Bottom (rank 2, no thermals): 105.11,162.38 106.53,162.38 106.53,160.27 arc-90 106.3,160.04 arc90 106.07,159.81 106.07,158.38 arc-90 105.07,157.38 104.68,157.38 arc-90 103.68,158.38 103.68,160.33 arc-90 104.4,161.04 arc90 105.11,161.75
  pour Bottom (rank 3, no thermals): 159.72,136.94 155.42,132.64 arc-90 154.55,132.64 153.76,133.44 arc-90 153.76,134.3 158.06,138.6 arc-90 158.92,138.6 159.72,137.8 arc-90
  pour Bottom (rank 2, no thermals): 88.93,141.78 90.62,143.47 94.8,139.29 arc-45 95.03,138.74 95.03,136.07 arc-45 94.85,135.64 93.57,134.36 arc-90 92.71,134.36 92.2,134.87 arc-90 92.2,136 93.02,136.83 arc90 93.02,137.69
  pour Bottom (rank 2, no thermals): 141.35,126.62 140.52,127.45 arc-90 140.52,128.31 143.46,131.24 arc-45 144.01,131.47 146.67,131.47 arc-45 147.1,131.29 148.39,130.01 arc-90 148.39,129.15 147.88,128.64 arc-90 146.75,128.64 145.92,129.46 arc90 145.06,129.46 142.21,126.62 arc-90
  pour Bottom (rank 3, no thermals): 100.5,123.03 96.2,127.33 arc-90 96.2,128.19 97,128.99 arc-90 97.86,128.99 102.16,124.69 arc-90 102.16,123.83 101.36,123.03 arc-90
+5V/1
  Bottom 1.272: J15.6 C18A.1 144.29,167.05 arc-90 146.29,169.05 151.32,169.05 arc-90 156.32,164.05 156.32,149.42 arc45 157.79,145.88 C7A.1 167.01,139.87 arc-90 172.01,134.87 172.01,125.38 arc-45 170.54,121.85 169.66,120.96 | 164.34,117.35 C15A.1 | 169.66,120.96 167.26,118.56 arc-45 164.34,117.35 | C11A.1 141.92,116.95 arc90 148.92,109.95 159.34,109.95 arc90 164.34,114.95 164.34,117.35 | C17A.1 169.66,120.96
  pour Bottom (no thermals): 161.51,135.14 164.84,138.48 arc90 164.84,140.26 arc90 163.06,140.26 159.73,136.93
  pour Bottom (no thermals): 147.71,121.12 arc-45 143.21,119.39 141.87,119.39 arc90 141.02,118.54 arc90 141.87,117.69 146.14,117.69 arc45 148.73,118.77 149.4,119.44
  pour Bottom (no thermals): 158.03,121.23 161.05,118.21 arc90 162.74,118.21 162.95,118.42 arc90 162.95,119.69 159.72,122.92
  pour Bottom (no thermals): 159.33,125.21 arc90 159.33,123.52 159.68,123.17 arc45 160.38,122.88 166.57,122.88 arc90 167.47,123.78 arc90 166.57,124.68 161.96,124.68 arc-45 161.26,124.97 161.02,125.21 arc90
  pour Bottom (rank 2, no thermals): 144.06,158.84 142.64,158.84 142.64,160.95 arc-90 142.87,161.18 arc90 143.1,161.41 143.1,162.84 arc-90 144.1,163.84 144.49,163.84 arc-90 145.49,162.84 145.49,160.89 arc-90 144.78,160.18 arc90 144.06,159.47
  pour Bottom (rank 2, no thermals): 155.52,132.53 156.62,133.63 arc45 156.69,133.8 arc-45 156.75,133.94 159.73,136.93 arc-90 160.59,136.93 161.51,136.01 arc-90 161.51,135.14 160.43,134.06 arc-45 160,133.88 158.86,133.88 arc45 158.43,133.71 157.74,133.02 arc-45 157.31,132.84 157.28,132.84 arc45 156.85,132.66 156.12,131.93 arc-180
  pour Bottom (rank 2, no thermals): 154.11,125.91 arc-180 154.71,126.51 156.96,124.26 arc45 157.39,124.08 158.3,124.08 arc-45 158.73,123.9 159.72,122.92 arc-90 159.72,122.06 158.89,121.23 arc-90 158.03,121.23 155.51,123.75 arc-45 155.33,124.18 155.33,124.44 arc45 155.15,124.87
  pour Bottom (rank 2, no thermals): 156.83,128.64 arc180 156.23,128.04 158.12,126.14 arc-45 158.3,125.71 158.3,124.8 arc45 158.48,124.37 159.82,123.03 arc90 160.69,123.03 161.51,123.85 arc90 161.51,124.72 159.77,126.46 arc45 159.33,126.64 159.08,126.64 arc-45 158.64,126.82
  pour Bottom (no thermals): 148.98,122.39 147.71,121.12 arc90 147.71,120.26 148.53,119.44 arc90 149.4,119.44 151.08,121.12 arc90 151.08,121.98 149.39,123.66 arc-90 149.39,124.52 149.75,124.88 arc45 149.93,125.31 149.93,125.48 arc-45 150.11,125.91 150.81,126.62 arc180 150.21,127.22 148.04,125.05 arc90 148.04,124.19 148.98,123.26 arc-90
+5V/2
  Bottom 1.272: 77.15,122.95 75.42,124.69 arc-45 73.95,128.22 73.95,132.52 arc-45 74.83,134.64 81.02,140.83 C11B.1 | 77.15,122.95 78.64,122.95 | 77.15,122.95 70.05,115.85 arc45 65.65,105.24 65.65,97.43 arc-90 C18B.1 J17.6 | 78.64,122.95 arc45 79.62,120.58 80.73,119.47 arc90 C17B.1 91.14,112.42 arc45 94.67,110.95 98.42,110.95 arc90 103.42,115.95 C7B.1 | C15B.1 78.64,122.95
  pour Bottom (no thermals): 82.89,139.14 82.89,144.12 80.09,144.12 79.09,143.12 79.09,138.91 arc45 80.26,136.08 83,133.35 84.68,135.04 83.83,135.89 arc-45 83.54,136.6 83.54,137.56 arc45 83.17,138.46 arc-45
  pour Bottom (no thermals): 98.7,121.23 101.68,118.26 arc45 103.09,117.67 103.48,117.67 arc90 104.75,118.94 arc90 103.48,120.22 arc-45 103.13,120.36 100.48,123.01
  pour Bottom (no thermals): 86.97,125.21 arc-90 86.97,123.52 86.63,123.17 arc-45 85.92,122.88 79.73,122.88 arc-90 78.83,123.78 arc-90 79.73,124.68 84.34,124.68 arc45 85.05,124.97 85.28,125.21 arc-90
  pour Bottom (no thermals): 88.28,121.23 85.26,118.21 arc-90 83.57,118.21 83.36,118.42 arc-90 83.36,119.69 86.59,122.92
  pour Bottom (rank 2, no thermals): 56.38,94.76 56.38,96.18 58.49,96.18 arc-90 58.72,95.95 arc90 58.95,95.72 60.38,95.72 arc-90 61.38,94.72 61.38,94.33 arc-90 60.38,93.33 58.44,93.33 arc-90 57.72,94.05 arc90 57.01,94.76
  pour Bottom (rank 2, no thermals): 96.09,127.22 97.19,126.13 arc45 97.36,126.05 arc-45 97.5,126 100.49,123.01 arc-90 100.49,122.15 99.57,121.23 arc-90 98.7,121.23 97.62,122.31 arc-45 97.44,122.74 97.44,123.89 arc45 97.27,124.32 96.58,125.01 arc-45 96.4,125.44 96.4,125.47 arc45 96.22,125.9 95.49,126.62 arc-180
  pour Bottom (no thermals): 85.95,133.77 84.68,135.04 arc90 83.82,135.04 83,134.21 arc90 83,133.35 84.68,131.67 arc90 85.54,131.67 87.22,133.35 arc-90 88.08,133.35 88.44,133 arc45 88.87,132.82 89.04,132.82 arc-45 89.47,132.64 90.18,131.93 arc180 90.78,132.53 88.61,134.7 arc90 87.75,134.7 86.82,133.77 arc-90
  pour Bottom (rank 2, no thermals): 92.2,125.91 arc180 91.6,126.51 89.7,124.62 arc-45 89.27,124.44 88.36,124.44 arc45 87.93,124.26 86.59,122.92 arc90 86.59,122.06 87.41,121.23 arc90 88.28,121.23 90.02,122.98 arc45 90.2,123.41 90.2,123.67 arc-45 90.38,124.1
  pour Bottom (rank 2, no thermals): 89.47,128.64 arc-180 90.07,128.04 87.82,125.78 arc45 87.64,125.35 87.64,124.44 arc-45 87.46,124.01 86.48,123.03 arc-90 85.62,123.03 84.79,123.85 arc-90 84.79,124.72 87.31,127.23 arc-45 87.74,127.41 88,127.41 arc45 88.43,127.59
+5V/3
  Bottom 1.272: J20.6 C18E.1 arc90 127.35,104.75 128.75,104.75 arc90 133.75,109.75 133.75,120.65 arc90 130.75,123.65 121.95,123.65 arc-90 119.95,125.65 119.95,126.9 arc-90 BD1.H3.17
  pour Bottom (rank 2, no thermals): 125.12,113.57 126.55,113.57 126.55,111.46 arc-90 126.32,111.23 arc90 126.09,111 126.09,109.57 arc-90 125.09,108.57 124.7,108.57 arc-90 123.7,109.57 123.7,111.52 arc-90 124.41,112.23 arc90 125.12,112.94
+5V/4
  Bottom 1.272: J19.6 C18F.1 57.38,107.32 arc45 58.25,105.2 arc90 62.82,105.2 arc45 63.7,107.32 63.7,111.58 arc-45 65.16,115.12 68.69,118.64 arc45 70.15,122.18 70.15,131.48 arc-45 71.62,135.02 79.06,142.46 arc-45 86.13,145.38 C5B.1
  pour Bottom (rank 2, no thermals): 88.87,145.42 arc90 87.79,146.5 84.04,146.5 arc90 83.04,145.5 83.04,134.94 83.86,134.12 86.52,136.79 84.97,138.34 arc-45 84.68,139.05 84.68,143.34 arc-90 85.68,144.34 87.79,144.34 arc90
  pour Bottom (rank 2, no thermals): 57.61,113.77 59.03,113.77 59.03,111.66 arc-90 58.8,111.43 arc90 58.57,111.2 58.57,109.77 arc-90 57.57,108.77 57.18,108.77 arc-90 56.18,109.77 56.18,111.72 arc-90 56.89,112.43 arc90 57.61,113.14
  pour Bottom (rank 2, no thermals): 84.79,136.01 86.47,137.68 arc-90 87.33,137.68 89.77,135.25 arc-45 89.86,135.03 89.86,135 arc45 89.95,134.78 91.49,133.24 arc-180 91.24,132.99 90.79,133.45 arc45 90.08,133.74 arc-45 89.58,133.95 88.61,134.92 arc90 87.75,134.92 86.82,133.98 arc-90 85.95,133.98 84.79,135.14 arc-90
+5V/5
  Bottom 1.272: J16.6 C18C.1 169.52,146.76 arc45 170.99,143.22 173.38,140.82 arc-45 174.85,137.29 174.85,117.73 arc-90 163.35,106.23 139.41,106.23 arc-90 136.41,109.23 136.41,122.02 arc-45 C5A.1
  pour Bottom (rank 2, no thermals): 136.76,123.78 139.31,121.23 arc90 147.6,121.23 145.91,122.92 144.99,122.02 arc-89 140.77,122.04 137.9,124.92 arc90 136.76,124.92 arc90
  pour Bottom (rank 2, no thermals): 169.75,158.28 171.17,158.28 171.17,156.16 arc-90 170.94,155.93 arc90 170.71,155.7 170.71,154.27 arc-90 169.71,153.27 169.33,153.27 arc-90 168.33,154.27 168.33,156.22 arc-90 169.04,156.93 arc90 169.75,157.64
  pour Bottom (rank 2, no thermals): 146.74,121.23 145.06,122.91 arc-90 145.06,123.77 147.5,126.21 arc-45 147.71,126.3 147.75,126.3 arc45 147.96,126.39 149.51,127.93 arc-180 149.75,127.68 149.29,127.23 arc45 149,126.52 arc-45 148.79,126.02 147.83,125.05 arc90 147.83,124.19 148.76,123.26 arc-90 148.76,122.39 147.6,121.23 arc-90
+240VDC  (via drill 0.35)
  Top 2.54: 123.15,62.75 C18.1 116.85,62.75 arc45 113.31,61.29 C2O2.1 arc45 110.15,57.95 R23.2 R22.2 | 123.15,62.75 C20.1 129.46,62.75 arc-45 132.99,61.29 C2O3.1 arc-45 136.15,57.95 R31.2 R30.2 | 123.15,31.25 C17.1 arc-45 116.74,27.84 108.37,19.46 arc-45 104.83,18 86.19,18 arc-90 81.19,23 SX5.6 | 123.15,31.25 C19.1 arc45 129.57,27.84 137.94,19.46 arc45 141.47,18 153.62,18 arc90 156.62,21 156.62,27.96 arc-45 158.09,31.49 SX7.6 | 123.15,62.75 123.15,31.25 | 123.15,62.75 v123.15,97.85 v123.15,99.79 v123.15,101.72
  Top 4: C6P.1 27.13,58.75 | 27.13,58.75 C5P.1 27.13,41.75 | 27.13,41.75 C9P.1 | R6P.1 arc45 5.37,33.14 C8P.1 10.38,36.75 arc-90 15.38,41.75 27.13,41.75 | R4P.2 59.99,31.67 arc45 56.45,33.14 C10P.1 C3P.1 51.38,58.75 | C7P.1 51.38,58.75 | 27.13,58.75 51.38,58.75
  Bottom 2.54: C7P.1 63.4,66.64 arc90 68.4,71.64 68.4,73.22 arc45 68.11,73.92 67.89,74.14 arc-45 67.6,74.84 67.6,89.18 arc-45 69.06,92.72 arc45 70.1,95.22 70.1,100.35 arc-90 74.1,104.35 120.52,104.35 arc-90 v123.15,101.72 v123.15,99.79 v123.15,97.85
AGND
  Bottom 0.305: IC3.37 87.47,132.06 C6A2.2 | IC9.37 150.69,123.91 C6A3.2
  Bottom 1.272: J2.2 81.7,128.13 C15B.2 | J10.7 164.6,128.13 C17A.2 | C5B.2 arc45 86.75,147.85 84.14,147.85 arc45 80.61,146.39 C11B.2
  pour Top (rank 5, no thermals): 68.15,136.68 68.15,0.61 arc90 68.76,0 177.39,0 arc90 178,0.61 178,133.8 arc46 177.81,134.24 167.18,144.53 arc44 166.75,144.7 164.5,144.7 arc45 164.07,144.53 144.01,124.46 arc-45 143.58,124.29 139.02,124.29 arc-45 138.59,124.46 136.58,126.47 arc45 136.15,126.65 134.45,126.65 arc45 134.02,126.47 132.01,124.46 arc-45 131.58,124.29 102.72,124.29 arc-45 102.29,124.46 81.78,144.97 arc45 81.35,145.15 76.63,145.15 arc45 76.19,144.97 68.33,137.11 arc45
  pour Bottom (rank 5, no thermals): 93.06,115.59 arc90 93.92,115.59
  pour Bottom (rank 5, no thermals): 152.38,115.59 arc90 153.25,115.59
  pour Bottom (rank 5, no thermals): 87.11,138.32 79.15,130.36 arc90 79.15,129.5 93.06,115.59 arc90 93.92,115.59 100.39,122.06 arc90 100.39,122.92 96,127.31 arc-45 95.82,127.75 95.82,129.36 arc45 95.64,129.79 90.93,134.51 arc-90 90.93,135.37 91.3,135.74 arc90 91.3,136.8 90.93,137.17 arc45 90.22,137.46 88.78,137.46 arc45 88.21,137.22
  pour Bottom (rank 5, no thermals): 144.42,123.55 152.38,115.59 arc90 153.25,115.59 167.16,129.5 arc90 167.16,130.36 160.69,136.83 arc90 159.82,136.83 155.43,132.44 arc-45 155,132.26 153.38,132.26 arc45 152.95,132.08 148.24,127.37 arc-90 147.37,127.37 147.01,127.74 arc90 145.95,127.74 145.58,127.37 arc45 145.28,126.66 145.28,125.22 arc45 145.52,124.65
  pour Bottom (no thermals): 68.76,0 177.39,0 arc90 178,0.61 178,102.19 arc90 177.39,102.8 68.76,102.8 arc90 68.15,102.19 68.15,0.61 arc90
BCLK
  Bottom 0.305: 123.15,155.82 121.9,157.08 arc45 121,157.45 IC4A.8 118.48,157.45 arc-90 117.48,158.45 117.48,159.4 arc45 116.89,160.81 J21.3 | 123.15,155.82 124.41,154.57 arc45 125.3,154.2 IC4A.18 127.83,154.2 arc-90 128.83,153.2 128.83,152.25 arc45 129.41,150.83 J22.3 | BD1.H3.11 121.01,137.33 arc-45 120.42,138.74 120.42,144.98 arc-45 121.01,146.4 122.57,147.96 arc45 123.15,149.37 123.15,155.82
DATA  (via drill 0.35)
  Top 0.305: v123.86,156.8 123.45,156.8 arc90 122.45,155.8 v122.45,154.85 | v117.48,154.85 117.48,154.37 arc-45 117.18,153.66 J21.7 | v128.83,156.8 128.83,157.27 arc-45 129.12,157.98 J22.7
  Bottom 0.305: v123.86,156.8 IC4A.14 v128.83,156.8 | v117.48,154.85 IC4A.4 v122.45,154.85 122.45,149.95 arc-45 121.86,148.54 120.19,146.86 arc45 119.6,145.45 119.6,137.02 arc45 120.19,135.61 BD1.H3.13
DGND  (via drill 0.35)
  Bottom 0.305: IC9.13 153.15,134.16 153.15,133.15 153.55,132.75 153.87,132.75 | IC9.16 153.87,132.75 | 153.87,132.75 154.4,132.22 arc90 154.75,132.22 IC9.18 | IC3.13 97.72,129.59 96.71,129.59 96.31,129.19 96.31,128.88 | IC3.16 96.31,128.88 | 96.31,128.88 95.78,128.35 arc90 95.78,127.99 IC3.18
  other vias: 137.48,149.92 136.78,150.63 128.83,154.85 117.48,156.8 135.37,152.03 136.07,151.33 134.67,154.73 134.67,153.73 134.67,152.74 134.67,156.72 134.67,155.72 134.67,162.69 134.67,161.69 134.67,160.7 134.67,159.7 134.67,158.71 134.67,164.68 134.67,163.69 134.67,157.71 111.69,153.54 111.69,152.55 111.67,151.52 112.4,154.25 112.4,162.21 112.4,161.21 112.4,160.22 112.4,159.22 112.4,158.23 112.4,155.24 112.4,157.23 112.4,156.24 112.4,163.21 140.47,149.92 141.46,149.92 138.48,149.92 139.47,149.92 142.87,148.51 142.17,149.22 110.96,150.82 110.26,150.11 108.85,148.71 109.55,149.41 128.18,136.86 131.17,134.82 132.16,134.82 129.18,136.86 130.17,136.86 133.57,133.41 132.87,134.12 128.18,130.52 131.17,130.52 132.16,130.52 129.18,130.52 130.17,130.52 126.19,130.52 127.19,130.52 126.19,136.86 127.19,136.86 112.15,145.41 112.85,146.11 131.17,129.53 130.46,128.82 129.06,127.41 129.76,128.12 128.35,126.71 127.65,126.01 125.5,143.82 125.5,149.79 125.5,148.79 125.5,147.8 125.5,146.8 125.5,145.81 125.5,151.78 125.5,150.79 125.5,144.81 118.32,133.26 117.62,133.97 119.73,131.86 119.03,132.56 117.62,135.96 117.62,134.96 141.87,141.63 141.87,140.63 60.6,135.91 61.3,136.61 65.2,134.11 65.9,134.81 120.81,149.79 120.81,151.78 120.81,150.79 149.1,133.67 97.21,133.67 94.55,154.45 89.01,150.68 87.6,149.27 88.31,149.98 137.82,126.31 139.23,124.91 138.53,125.61 108.05,136.24 136.42,127.72 137.12,127.02 101.97,148.96 103.38,147.55 102.68,148.26 104.08,146.85 105.49,145.44 104.79,146.15 100.42,145.01 101.83,143.6 101.13,144.31 102.53,142.9 110.87,135.96 112.28,134.55 111.58,135.26 111.58,133.85 110.17,132.44 110.87,133.15 110.17,131.45 112.16,131.45 111.16,131.45 115.67,129.06 116.38,128.36 117.08,127.65 118.49,126.25 117.78,126.95 60.74,128.36 62.74,128.36 61.74,128.36
  pour Top (rank 6): 0.61,174.85 177.39,174.85 arc-90 178,174.24 178,25.66 arc-90 177.39,25.05 0.61,25.05 arc-90 0,25.66 0,174.24 arc-90
  pour Bottom (rank 6, no thermals): 0.61,174.85 177.39,174.85 arc-90 178,174.24 178,25.66 arc-90 177.39,25.05 0.61,25.05 arc-90 0,25.66 0,174.24 arc-90
  pour Bottom (rank 6, no thermals): 172.97,153.27 163.53,153.27 arc-90 162.92,153.88 162.92,163.32 arc-90 163.53,163.93 172.97,163.93 arc-90 173.58,163.32 173.58,153.88 arc-90
  pour Top (no thermals): 140.23,163.22 140.23,153.78 arc90 140.84,153.17 150.28,153.17 arc90 150.89,153.78 150.89,163.22 arc90 150.28,163.83 140.84,163.83 arc90
  pour Bottom (rank 6, no thermals): 150.89,163.23 150.89,153.79 arc-90 150.28,153.18 140.84,153.18 arc-90 140.23,153.79 140.23,163.23 arc-90 140.84,163.84 150.28,163.84 arc-90
  pour Top (no thermals): 162.92,163.32 162.92,153.87 arc90 163.53,153.26 172.97,153.26 arc90 173.58,153.87 173.58,163.32 arc90 172.97,163.92 163.53,163.92 arc90
  pour Bottom (rank 6, no thermals): 61.38,97.98 61.38,88.54 arc-90 60.77,87.93 51.33,87.93 arc-90 50.72,88.54 50.72,97.98 arc-90 51.33,98.59 60.77,98.59 arc-90
  pour Top (no thermals): 50.72,97.98 50.72,88.54 arc90 51.33,87.93 60.77,87.93 arc90 61.38,88.54 61.38,97.98 arc90 60.77,98.59 51.33,98.59 arc90
  pour Bottom (rank 6, no thermals): 108.33,157.38 98.89,157.38 arc-90 98.28,157.99 98.28,167.43 arc-90 98.89,168.04 108.33,168.04 arc-90 108.94,167.43 108.94,157.99 arc-90
  pour Top (no thermals): 98.28,167.43 98.28,157.99 arc90 98.89,157.38 108.33,157.38 arc90 108.94,157.99 108.94,167.43 arc90 108.33,168.04 98.89,168.04 arc90
  pour Bottom (rank 6, no thermals): 50.78,109.38 50.78,118.82 arc-90 51.39,119.43 60.83,119.43 arc-90 61.44,118.82 61.44,109.38 arc-90 60.83,108.77 51.39,108.77 arc-90
  pour Top (no thermals): 60.83,119.43 51.39,119.43 arc90 50.78,118.82 50.78,109.38 arc90 51.39,108.77 60.83,108.77 arc90 61.44,109.38 61.44,118.82 arc90
  pour Bottom (rank 6, no thermals): 128.34,108.57 118.9,108.57 arc-90 118.29,109.18 118.29,118.62 arc-90 118.9,119.23 128.34,119.23 arc-90 128.95,118.62 128.95,109.18 arc-90
  pour Top (no thermals): 128.95,109.18 128.95,118.62 arc90 128.34,119.23 118.9,119.23 arc90 118.29,118.62 118.29,109.18 arc90 118.9,108.57 128.34,108.57 arc90
  pour Bottom (no thermals): 96.52,128.92 97.86,127.57 97.61,127.33 96.27,128.67
  pour Bottom (rank 6, no thermals): 77.15,131.5 93.06,115.59 arc90 93.92,115.59 107.83,129.5 arc90 107.83,130.36 91.92,146.27 arc90 91.06,146.27 77.15,132.36 arc90
  pour Bottom (no thermals): 153.83,132.96 155.17,134.3 155.42,134.05 154.07,132.71
  pour Bottom (rank 6, no thermals): 167.59,129.93 153.25,144.27 arc90 152.38,144.27 138.47,130.36 arc90 138.47,129.5 152.81,115.16
DIF0  (via drill 0.35)
  Top 0.305: U$1.1-TX1 49.86,164.87 arc45 48.4,161.33 48.4,153.07 arc90 51.4,150.07 67.25,150.07 arc45 69.37,150.95 71.34,152.92 arc-45 74.87,154.38 82.01,154.38 arc45 85.55,155.85 v86.25,156.55 | v132.47,168.95 132.47,151.05 arc90 137.47,146.05 151.61,146.05 arc-90 154.61,143.05 J9.7
  Bottom 0.305: IC9.10 150.56,134.66 arc-90 150.56,135.53 154.43,139.4 arc45 154.61,139.84 J9.7 | v86.25,156.55 86.55,156.85 arc45 88.01,160.38 arc-45 89.43,163.82 96.11,170.49 arc-45 99.64,171.95 113.68,171.95 arc-45 117.22,170.49 119.89,167.82 arc45 123.42,166.35 124.58,166.35 arc45 128.12,167.82 arc-45 130.86,168.95 v132.47,168.95
DIF1  (via drill 0.35)
  Top 0.305: U$1.2-OUT2 51.16,163.63 arc45 49.7,160.09 49.7,153.61 arc90 50.7,152.61 67.12,152.61 arc45 69.25,153.49 71.21,155.46 arc-45 74.75,156.92 82.01,156.92 arc45 85.55,158.39 v86.25,159.09 | v133.29,170.08 133.29,152.18 arc90 138.29,147.18 152.41,147.18 arc-90 156.41,143.18 J9.6
  Bottom 0.305: IC9.11 151.09,134.84 arc-90 151.09,135.35 152.56,136.83 arc-45 153,137.01 154.25,137.01 arc45 154.68,137.19 J9.6 | v133.29,170.08 129.95,170.08 arc45 126.41,168.61 arc-45 124.33,167.75 123.59,167.75 arc-45 121.47,168.63 118.22,171.89 arc45 114.68,173.35 98.48,173.35 arc45 94.95,171.89 87.72,164.66 arc45 86.25,161.12 v86.25,159.09
L+
  Top 1.272: R23O1.1 164.8,80.65 arc-45 168.33,79.18 R24O1.1 172.49,75.03 arc-45 173.95,71.49 173.95,55.94 arc45 175.42,52.4 R29.2
L-
  Top 1.272: R28.2 143.4,77.96 arc45 R26O1.1 arc45 147,79 153.15,79 arc90 155.15,81 arc45 153.99,83.8 R25O1.1
L_OUT
  Top 1.272: J26.2 139.59,6.46 arc45 143.12,5 167.35,5 arc45 170.89,6.46 C21O3.1
LRCK  (via drill 0.35)
  Top 0.305: v121.75,154.2 121.75,155.95 arc-90 123.25,157.45 v124.56,157.45
  Bottom 0.305: v124.56,157.45 IC4A.13 127.83,157.45 arc90 128.83,158.45 128.83,159.4 arc-45 129.41,160.81 J22.8 | J21.8 116.89,150.83 arc45 117.48,152.25 117.48,153.2 arc-90 118.48,154.2 IC4A.3 v121.75,154.2 121.75,150.53 arc-45 121.16,149.12 119.37,147.33 arc45 118.78,145.91 118.78,135.3 arc45 119.37,133.89 BD1.H3.15
MCLK  (via drill 0.35)
  Top 0.305: v86.59,144.19 arc-90 86.59,146.39 92.53,152.33 arc-90 96.78,152.33 113.31,135.79 arc90 116.14,135.79 BD1.H3.7 121.88,142.82 arc-90 122.22,143.16 123.96,143.16 arc90 124.31,143.51 124.31,143.55 arc90 123.96,143.89 122.34,143.89 arc-90 122,144.24 122,144.28 arc-90 122.34,144.62 123.96,144.62 arc90 124.31,144.97 124.31,145.01 arc90 123.96,145.36 122.34,145.36 arc-90 122,145.7 122,145.74 arc-90 122.34,146.09 123.96,146.09 arc90 124.31,146.43 124.31,146.47 arc90 123.96,146.82 122.34,146.82 arc-90 122,147.16 122,147.2 arc-90 122.34,147.55 123.96,147.55 arc90 124.31,147.89 124.31,147.93 arc90 123.96,148.28 122.34,148.28 arc-90 122,148.62 122,148.66 arc-90 122.34,149.01 123.96,149.01 arc90 124.31,149.35 124.31,149.39 arc90 123.96,149.74 122.34,149.74 arc-90 122,150.08 122,150.13 arc-90 122.34,150.47 123.96,150.47 arc90 124.31,150.81 124.31,150.86 arc90 123.96,151.2 122.34,151.2 arc-90 122,151.54 122,151.59 arc-90 122.34,151.93 123.96,151.93 arc90 124.31,152.27 124.31,152.32 arc90 123.96,152.66 123.5,152.66 arc-90 123.15,153 arc-45 123.54,153.94 125.39,155.79 arc90 125.39,157.91 v124.56,158.75
  Bottom 0.305: v124.56,158.75 IC4A.11 126.7,162.35 arc-45 127.29,163.77 J22.10 | BD1.H3.7 122.57,140.85 arc-45 123.15,139.43 123.15,133.64 arc90 124.15,132.64 125.92,132.64 arc-90 126.26,132.3 126.26,131.98 arc90 126.6,131.64 126.77,131.64 arc90 127.12,131.98 127.12,135.34 arc-90 127.46,135.68 127.63,135.68 arc-90 127.97,135.34 127.97,131.98 arc90 128.31,131.64 128.48,131.64 arc90 128.83,131.98 128.83,135.34 arc-90 129.17,135.68 129.34,135.68 arc-90 129.68,135.34 129.68,131.98 arc90 130.03,131.64 130.19,131.64 arc90 130.54,131.98 130.54,132.3 arc-90 130.88,132.64 arc-45 134.41,131.18 R4A.1 | v86.59,144.19 86.59,143.11 arc-45 R4B.1
N$1
  Bottom 0.305: IC4A.1 119.6,149.29 arc-45 119.02,147.88 J21.10 116.01,143.91 arc-45 116.31,143.2 R21A.1
N$2
  pour Bottom (rank 2, no thermals): 82.89,133.24 81.2,131.55 80.66,132.09 arc45 78.75,132.88 77.71,132.88 arc-90 77.07,133.52 arc-90 77.71,134.16 80.85,134.16 arc-45 82.76,133.36
  pour Bottom (rank 2, no thermals): 85.56,130.57 82.89,133.24 arc90 82.03,133.24 81.2,132.41 arc90 81.2,131.55 82.64,130.11 arc45 83.07,129.93 84.67,129.93 arc-45 85.11,129.75 85.81,129.05 arc45 86.24,128.87 87.83,128.87 arc45 88.26,129.05 89.42,130.21 arc90 89.42,131.07 88.6,131.88 arc90 87.74,131.88 86.42,130.57 arc-90
N$4
  Bottom 0.305: IC4A.6 117.31,156.15 arc-45 115.89,156.73 J21.5
N$5
  Bottom 0.305: IC4A.16 129,155.5 arc-45 130.41,154.91 J22.5
N$14
  Bottom 0.305: C19A.1 R7A.1 J15.4 141.75,157.01 arc-90 142.75,158.01 IC1.7
N$15
  Bottom 1.272: D9.2 60.55,167.46 arc45 64.08,168.93 U$1.VUSB
N$17
  Bottom 0.305: IC5.4 55.55,90.45 arc-90 54.55,89.45 J17.1 R8B.2
N$18
  Bottom 0.305: IC5.6 53.6,95.47 arc45 52.89,95.18 J17.3
N$19
  pour Bottom (no thermals): 167.63,132.74 168.5,132.74 arc90 169.14,133.38 arc90 168.5,134.02 165.29,134.02 arc45 163.42,133.24 165.1,131.55 165.35,131.8 arc-45
  pour Bottom (rank 2, no thermals): 160.99,131.61 161.54,131.61 arc45 161.97,131.79 163.42,133.24 arc-90 164.28,133.24 165.1,132.41 arc-90 165.1,131.55 164,130.44 arc-45 163.57,130.27 160.52,130.27 arc-45 160.09,130.44 158.85,131.68 arc90 157.99,131.68 157.18,130.87 arc-180 156.94,131.12 157.94,132.12 arc-45 158.37,132.3 159.8,132.3 arc-45 160.23,132.12 160.56,131.79 arc45
N$20
  Bottom 0.305: 96.67,134.17 arc-45 97.1,134.35 98.8,134.35 arc-45 99.23,134.17 99.7,133.7 arc45 100.13,133.52 | IC3.5 96.67,134.17 | 96.67,134.17 | 100.13,133.52 J4.3 R3B.2 | 100.13,133.52
N$21
  Bottom 0.305: IC9.46 148.01,127.6 arc-90 147.14,127.6 147.01,127.74 arc90 145.94,127.74 145.58,127.37 arc45 145.28,126.66 145.28,125.3 arc45 145.58,124.6 J11.4 R4A.2
N$22
  Bottom 0.305: R6B.1 J17.2 52.89,91.34 arc45 53.6,91.05 IC5.5
N$23
  Bottom 0.305: IC4A.19 127.51,153.55 arc-90 128.01,153.05 128.01,150.53 arc45 128.59,149.11 J22.2 132.17,145.54 arc45 132.87,145.25 133.43,145.25 arc-90 133.77,144.9 133.77,143.51 arc90 134.12,143.17 134.22,143.17 arc90 134.57,143.51 134.57,145.3 arc-90 134.91,145.64 135.02,145.64 arc-90 135.36,145.3 135.36,143.51 arc90 135.7,143.17 135.81,143.17 arc90 136.15,143.51 136.15,145.3 arc-90 136.5,145.64 136.6,145.64 arc-90 136.94,145.3 136.94,143.51 arc90 137.29,143.17 137.4,143.17 arc90 137.74,143.51 137.74,145.3 arc-90 138.08,145.64 138.19,145.64 arc-90 138.53,145.3 arc90 138.87,144.95 141.44,144.95 arc-45 142.15,144.66 143.05,143.76 arc-45 143.34,143.05 R1A.1
N$24